# EAGLE design Pixie84 (EAGLE 7.5.0)
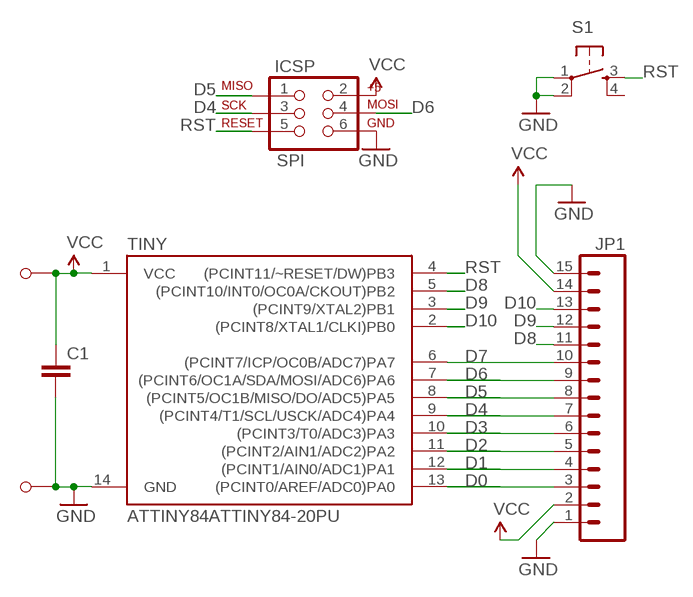
[diagram p0: schematic, sheet 1]

## Parts
C1  CAPPTH  [CAP-PTH-SMALL]
ICSP  SPI  AVR_SPI_PRG_6LABELED  [2X3-NS]
JP1  M15  [1X15]
S1  TAC_SWITCHPTH  [TACTILE-PTH]
TINY  ATTINY84ATTINY84-20PU  [DIL14]
U$1  M1  [M1_NO_STRAIN]
U$2  M1  [M1_NO_STRAIN]

## Nets
D0: JP1.3 TINY.13((PCINT0/AREF/ADC0)PA0)
D1: JP1.4 TINY.12((PCINT1/AIN0/ADC1)PA1)
D2: JP1.5 TINY.11((PCINT2/AIN1/ADC2)PA2)
D3: JP1.6 TINY.10((PCINT3/T0/ADC3)PA3)
D4: ICSP.3(SCK) JP1.7 TINY.9((PCINT4/T1/SCL/USCK/ADC4)PA4)
D5: ICSP.1(MISO) JP1.8 TINY.8((PCINT5/OC1B/MISO/DO/ADC5)PA5)
D6: ICSP.4(MOSI) JP1.9 TINY.7((PCINT6/OC1A/SDA/MOSI/ADC6)PA6)
D7: JP1.10 TINY.6((PCINT7/ICP/OC0B/ADC7)PA7)
D8: JP1.11 TINY.5((PCINT10/INT0/OC0A/CKOUT)PB2)
D9: JP1.12 TINY.3((PCINT9/XTAL2)PB1)
D10: JP1.13 TINY.2((PCINT8/XTAL1/CLKI)PB0)
GND: C1.2 ICSP.6(GND) JP1.1 JP1.15 S1.1 S1.2 TINY.14(GND) U$2.P$1
RST: ICSP.5(RST) S1.3 TINY.4((PCINT11/~RESET/DW)PB3)
VCC: C1.1 ICSP.2(V+) JP1.2 JP1.14 TINY.1(VCC) U$1.P$1
Unconnected: S1.4

## Library data of the parts
C1 = barbary_enterprises:CAP: Capacitor Standard 0603 ceramic capacitor, and 0.1" leaded capacitor.
ICSP = barbary_enterprises:AVR_SPI_PRG_6: AVR ISP 6 Pin This is the reduced ISP connector for AVR programming. Common on Arduino. This footprint will take up less PCB space and can be used with a 10-pin to 6-pin adapter such as SKU: BOB-08508
JP1 = SparkFun-Connectors:M15: Header 15 Standard 15-pin 0.1" header. Use with straight break away headers (SKU : PRT-00116), right angle break away headers (PRT-00553), swiss pins (PRT-00743), machine pins (PRT-00117), and female headers (PRT-00115).
S1 = barbary_enterprises:TAC_SWITCH: Momentary Switch Button commonly used for reset or general input. Spark Fun Electronics SKU : COM-00097 SMT- SWCH-08247
TINY = SparkFun-DigitalIC:ATTINY84: Atmel 14-pin 2/4/8kB flash uC
U$1 U$2 = barbary_enterprises:M1

## Board
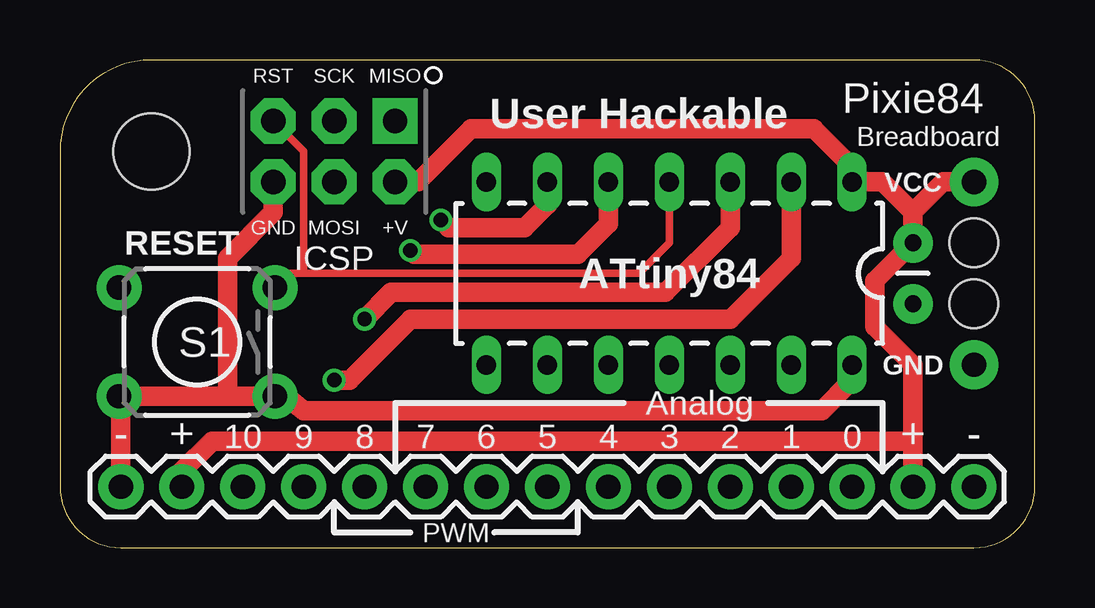
[diagram p1: board, top side]
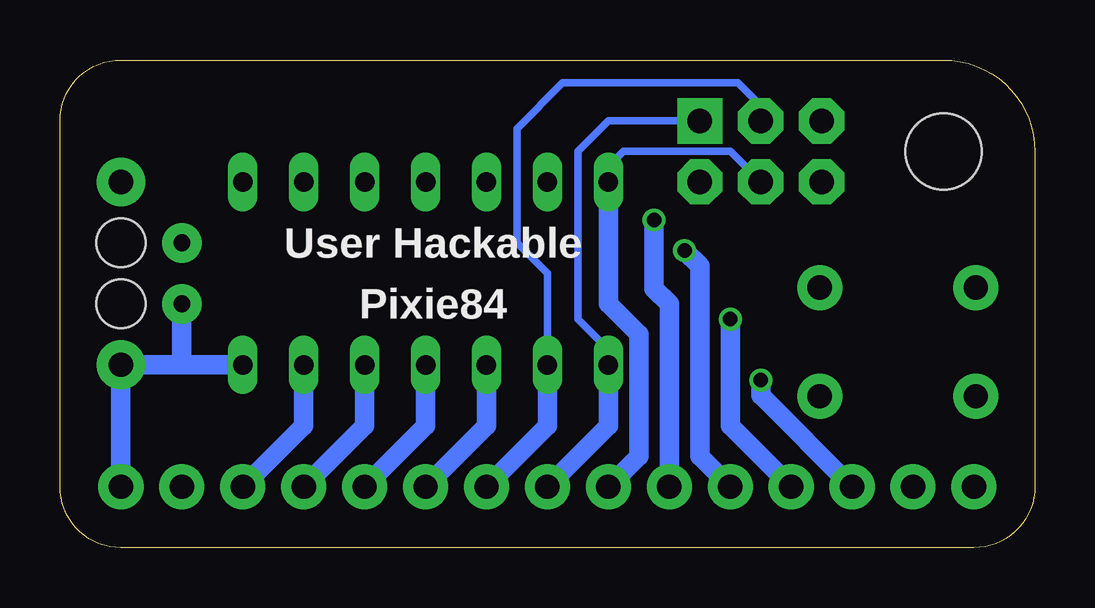
[diagram p2: board, bottom side, seen from below]

Size 40.64 x 20.32 mm. Coordinates in mm from the lower left corner, seen from the top.
Outline: 40.64,2.54 40.64,17.78 arc90 38.1,20.32 3.81,20.32 arc90 0,16.51 0,2.54 arc90 2.54,0 38.1,0 arc90 40.64,2.54
Copper layers (1*16): Top 0.0356mm / dielectric 1.5011mm / Bottom 0.0356mm
Design rules "LaenPCBOrder": minimum track width 6mil, minimum drill 13mil, track to track 6mil, track to pad 6mil, pad to pad 6mil, via to via 6mil, smd to smd 6mil, copper to edge 15mil, drill to drill 6mil, minimum pad ring 7mil, minimum via ring 7mil, stop-mask expansion 3mil, vias tented up to drill 0mil, thermal gap 10mil
Holes 3.17 mm at 3.81,16.51

### Footprints (pad centres in the part's own frame; a part is rotated, then mirrored left to right if it is on the bottom)
CAP-PTH-SMALL = drill 0.7 pad 1.651: 1 0,0; 2 2.54,0
2X3-NS = drill 1.016 pad 1.88 square: 1 -2.54,-1.27 | drill 1.016 pad 1.88 octagon: 2 -2.54,1.27; 3 0,-1.27; 4 0,1.27; 5 2.54,-1.27; 6 2.54,1.27
1X15 = drill 1.016 pad 1.88: 1 0,0; 2 2.54,0; 3 5.08,0; 4 7.62,0; 5 10.16,0; 6 12.7,0; 7 15.24,0; 8 17.78,0; 9 20.32,0; 10 22.86,0; 11 25.4,0; 12 27.94,0; 13 30.48,0; 14 33.02,0; 15 35.56,0
TACTILE-PTH = drill 1.016 pad 1.88: 1 -3.251,2.261; 2 3.251,2.261; 3 -3.251,-2.261; 4 3.251,-2.261
DIL14 = drill 0.813 long: 1 -8.89,-3.81; 2 -6.35,-3.81; 3 -3.81,-3.81; 4 -1.27,-3.81; 5 1.27,-3.81; 6 3.81,-3.81; 7 6.35,-3.81; 8 6.35,3.81; 9 3.81,3.81; 10 1.27,3.81; 11 -1.27,3.81; 12 -3.81,3.81; 13 -6.35,3.81; 14 -8.89,3.81
M1_NO_STRAIN = drill 1.016 pad 2.032: P$1 0,0 | hole 2.032: 2.54,0

### Placement (x,y rotation side)
C1  35.56,12.7 270 top
ICSP  11.43,16.51 180 top
JP1  38.1,2.54 180 top
S1  5.71,8.57 180 top
TINY  24.13,11.43 180 top
U$1  38.1,15.24 270 top
U$2  38.1,7.62 90 top

### Tracks (layer width: path | path; a pad name or v marks a point on that pad's centre or on a via)
D0
  Bottom 0.813: TINY.13 30.48,5.08 JP1.3
D1
  Bottom 0.813: TINY.12 27.94,5.08 JP1.4
D2
  Bottom 0.813: TINY.11 25.4,5.08 JP1.5
D3
  Bottom 0.813: TINY.10 22.86,5.08 JP1.6
D4
  Bottom 0.305: TINY.9 20.32,11.43 21.59,12.7 21.59,17.46 19.68,19.37 12.38,19.37 11.43,18.41 ICSP.3
  Bottom 0.813: TINY.9 20.32,5.08 JP1.7
D5
  Bottom 0.305: TINY.8 17.78,8.26 19.05,9.53 19.05,16.51 17.78,17.78 ICSP.1
  Bottom 0.813: TINY.8 17.78,5.08 JP1.8
D6
  Bottom 0.305: ICSP.4 12.7,16.51 17.14,16.51 17.78,15.88 TINY.7
  Bottom 0.813: JP1.9 16.51,3.81 16.51,8.89 17.78,10.16 TINY.7
D7  (via drill 0.6)
  Top 0.813: TINY.6 20.32,14.29 19.37,13.34 16.19,13.34 v15.88,13.65
  Bottom 0.813: JP1.10 15.24,10.16 15.88,10.79 v15.88,13.65
D8  (via drill 0.6)
  Top 0.813: TINY.5 22.86,13.49 21.59,12.22 14.76,12.22 v14.61,12.38
  Bottom 0.813: v14.61,12.38 13.97,11.75 13.97,3.81 JP1.11
D9  (via drill 0.6)
  Top 0.813: TINY.3 27.94,13.34 25.24,10.64 13.81,10.64 v12.7,9.53
  Bottom 0.813: v12.7,9.53 12.7,5.08 JP1.12
D10  (via drill 0.6)
  Top 0.813: TINY.2 30.48,12.06 27.94,9.53 14.61,9.53 12.06,6.99 v11.43,6.99
  Bottom 0.813: v11.43,6.99 11.43,6.35 JP1.13
GND
  Top 0.813: TINY.14 33.02,6.99 31.75,5.71 10.16,5.71 9.28,6.43 S1.1 6.99,6.31 | 6.99,6.31 S1.2 2.54,6.24 JP1.15 | ICSP.6 8.89,13.97 6.99,12.06 6.99,6.31
  Bottom 0.813: JP1.1 U$2.P$1 35.56,7.62 | TINY.14 35.56,7.62 | C1.2 35.56,7.62
RST
  Top 0.305: TINY.4 25.4,12.7 24.13,11.43 10.16,11.43 | 10.16,11.43 9.56,11.43 S1.3 | ICSP.5 10.16,16.51 10.16,11.43
VCC
  Top 0.813: U$1.P$1 36.83,15.24 35.56,13.97 | 35.56,13.97 C1.1 33.97,11.11 33.97,9.21 35.56,7.62 35.56,4.45 | 35.56,13.97 34.29,15.24 TINY.1 33.02,15.88 31.43,17.46 17.14,17.46 14.92,15.24 ICSP.2 | 35.56,4.45 JP1.2 | JP1.14 5.08,3.17 6.35,4.45 35.56,4.45

### Text on the board
tPlace: Pixie84 | User Hackable | Breadboard | VCC | RESET | ICSP | ATtiny84 | GND | Analog | - | + | 10 | 9 | 8 | 7 | 6 | 5 | 4 | 3 | 2 | 1 | 0 | + | - | PWM
bPlace: User Hackable | Pixie84